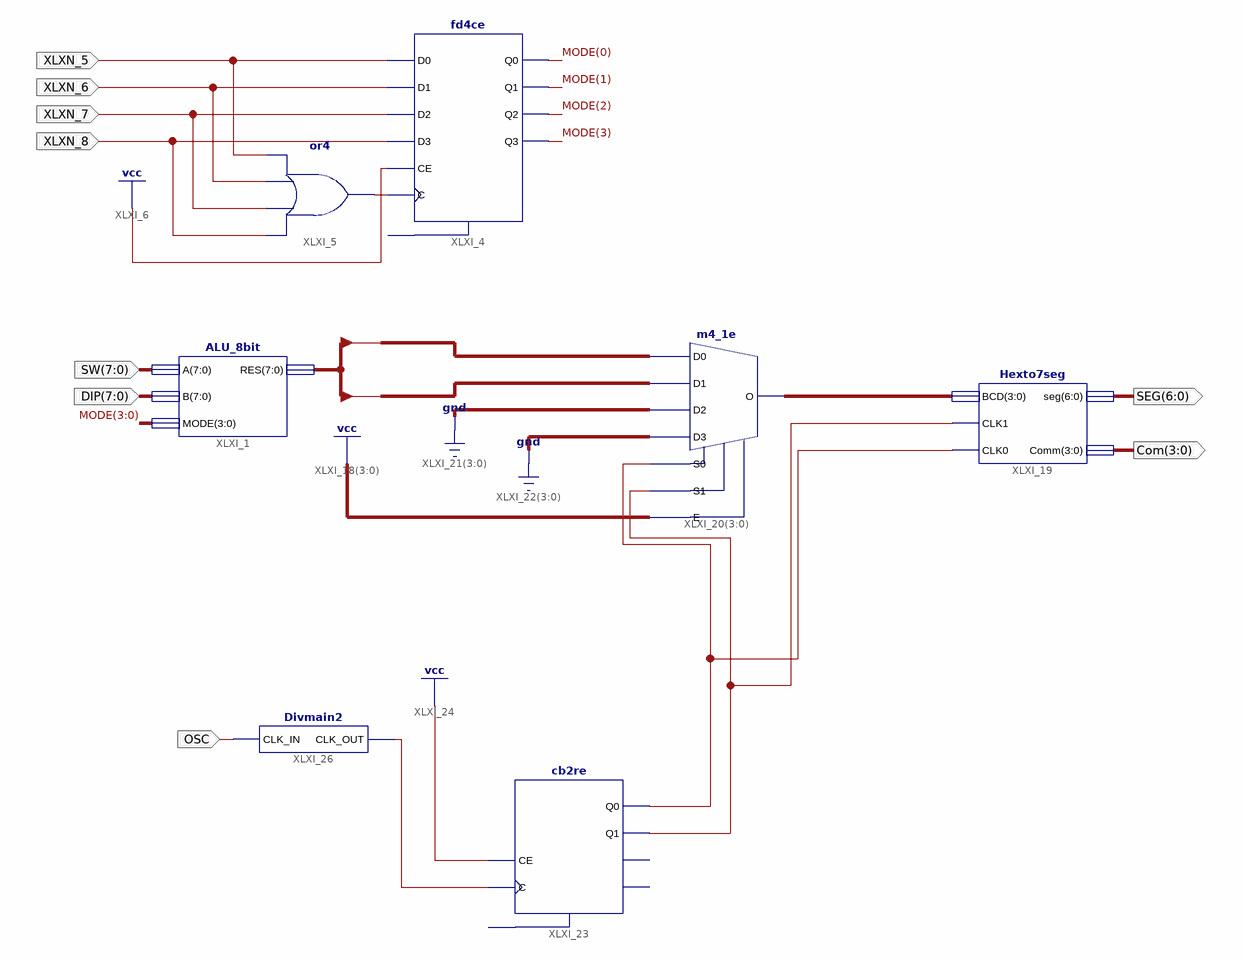
[diagram p0: schematic sheet 1]
// Xilinx ISE schematic main.sch (spartan6) as structural Verilog: 7 symbols, 9 ports
module main (
  input  XLXN_5,
  input  XLXN_6,
  input  XLXN_8,
  input  XLXN_7,
  input  [7:0] SW,
  input  [7:0] DIP,
  input  OSC,
  output [6:0] SEG,
  output [3:0] Com
);

  wire XLXN_9, XLXN_68, XLXN_69, XLXN_71;
  wire [3:0] MODE, XLXN_65;
  wire [7:0] RES;

  or XLXI_5 (XLXN_9, XLXN_8, XLXN_7, XLXN_6, XLXN_5);
  fd4ce XLXI_4 (
    .C(XLXN_9), .CE(1'b1), .D0(XLXN_5), .D1(XLXN_6), .D2(XLXN_7), .D3(XLXN_8), .Q0(MODE[0]), .Q1(MODE[1]),
    .Q2(MODE[2]), .Q3(MODE[3]));  // open: CLR
  ALU_8bit XLXI_1 (.A(SW), .B(DIP), .MODE(MODE), .RES(RES));
  Hexto7seg XLXI_19 (.BCD(XLXN_65), .CLK1(XLXN_69), .CLK0(XLXN_68), .seg(SEG), .Comm(Com));
  m4_1e XLXI_20[3:0] (
    .D0(RES[3:0]), .D1(RES[7:4]), .D2(4'b0000), .D3(4'b0000), .E(4'b1111), .S0(XLXN_68), .S1(XLXN_69),
    .O(XLXN_65));
  cb2re XLXI_23 (.C(XLXN_71), .CE(1'b1), .Q0(XLXN_68), .Q1(XLXN_69));  // open: R, CEO, TC
  Divmain2 XLXI_26 (.CLK_IN(OSC), .CLK_OUT(XLXN_71));

  // Notes on the sheet:
  //   LOC on signal XLXN_5 = P48
  //   LOC on signal XLXN_6 = P47
  //   LOC on signal XLXN_8 = P45
  //   LOC on signal XLXN_7 = P46
  //   LOC on signal SW(7:0) = P55,P56,P57,P58,P59,P61,P62,P66
  //   LOC on signal DIP(7:0) = P112,P111,P105,P104,P102,P101,P100,P99
  //   LOC on signal OSC = P123
  //   LOC on signal SEG(6:0) = P27,P29,P32,P34,P35,P40,P41
  //   LOC on signal Com(3:0) = P30,P33,P43,P44
endmodule
